# Altium schematic sheet RS-485.SchDoc
size A4; SheetNumber: 10; SheetTotal: 22
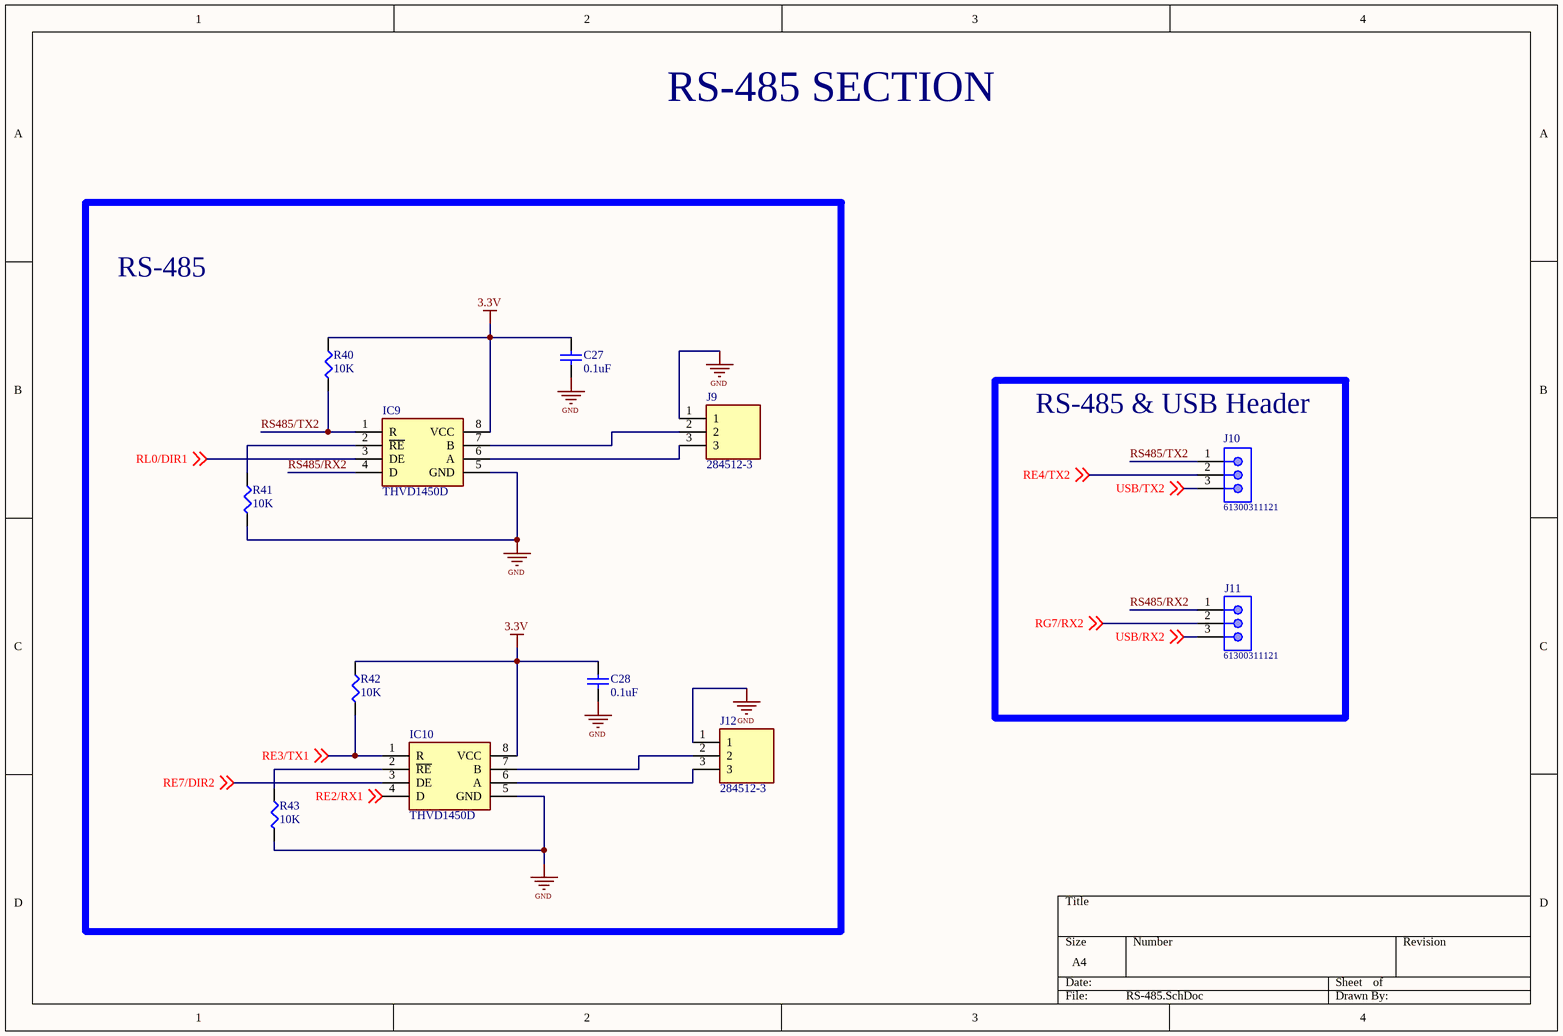
[diagram p0: RS-485.SchDoc]

## Parts
C27  value 0.1uF  [C1206]  (hidden comment: 10pF)
C28  value 0.1uF  [C1206]  (hidden comment: 10pF)
IC9  THVD1450D  [SOIC127P600X175-8N]
IC10  THVD1450D  [SOIC127P600X175-8N]
J9  284512-3  [SHDRRA3W80P0X350_1X3_1250X920X745P]
J10  61300311121  [61300311121]
J11  61300311121  [61300311121]
J12  284512-3  [SHDRRA3W80P0X350_1X3_1250X920X745P]
R40  10K  [SMD-0805-RES]
R41  10K  [SMD-0805-RES]
R42  10K  [SMD-0805-RES]
R43  10K  [SMD-0805-RES]

## Blocks framed on the sheet
RS-485: C27 C28 IC9 IC10 J9 J12 R40-R43
RS-485 & USB Header: J10 J11

## Nets
3.3V: C27.2 C28.2 IC9.8(VCC) IC10.8(VCC) R40.1 R42.1
GND: C27.1 C28.1 IC9.5(GND) IC10.5(GND) J9.1 J12.1 R41.2 R43.2
RE2/RX1: IC10.4(D) ; off-sheet RE2/RX1
RE3/TX1: IC10.1(R) R42.2 ; off-sheet RE3/TX1
RE4/TX2: J10.2 ; off-sheet RE4/TX2
RE7/DIR2: IC10.3(DE) ; off-sheet RE7/DIR2
RG7/RX2: J11.2 ; off-sheet RG7/RX2
RL0/DIR1: IC9.3(DE) ; off-sheet RL0/DIR1
RS485/RX2: IC9.4(D) J11.1
RS485/TX2: IC9.1(R) J10.1 R40.2
USB/RX2: J11.3 ; off-sheet USB/RX2
USB/TX2: J10.3 ; off-sheet USB/TX2
NetIC9_2: IC9.2(~{RE}) R41.1
NetIC9_6: IC9.6(A) J9.3
NetIC9_7: IC9.7(B) J9.2
NetIC10_2: IC10.2(~{RE}) R43.1
NetIC10_6: IC10.6(A) J12.3
NetIC10_7: IC10.7(B) J12.2

## Notes on the sheet
- RS-485 SECTION

## Library data of the parts
C27 C28 = Cap Semi: Capacitor (Semiconductor SIM Model); PART NUMBER: C0603C100M5HACTU; Published: 8-Jun-2000; LatestRevisionDate: 29-May-2009; LatestRevisionNote: IPC-7351 Footprint Added.; PackageReference: C1206; Publisher: Altium Limited; PackageDescription: Chip Capacitor; Source: Mouser
IC9 IC10 = THVD1450D: Integrated Circuit; Manufacturer_Name: Texas Instruments; Datasheet Link: http://www.ti.com/lit/gpn/THVD1450; Height: 1.75mm; Manufacturer_Part_Number: THVD1450D; Mouser Part Number: 595-THVD1450D; Mouser Price/Stock: https://www.mouser.co.uk/ProductDetail/Texas-Instruments/THVD1450D?qs=chTDxNqvsylemUKR9F4kpw%3D%3D; Arrow Part Number: THVD1450D; Arrow Price/Stock: https://www.arrow.com/en/products/thvd1450d/texas-instruments?region=nac
J9 J12 = 284512-3: Connector; Manufacturer_Name: TE Connectivity; Datasheet Link: https://www.te.com/commerce/DocumentDelivery/DDEController?Action=showdoc&DocId=Customer+Drawing%7F284512%7FE4%7Fpdf%7FEnglish%7FENG_CD_284512_E4.pdf%7F284512-3; Height: 7.45mm; Manufacturer_Part_Number: 284512-3; Mouser Part Number: 571-284512-3; Mouser Price/Stock: https://www.mouser.co.uk/ProductDetail/TE-Connectivity/284512-3?qs=woBvfblj%2Fzwah7g8QvojCQ%3D%3D; Arrow Part Number: 284512-3; Arrow Price/Stock: https://www.arrow.com/en/products/284512-3/te-connectivity?region=nac
J10 J11 = 61300311121: WR-PHD Pin Header, THT, pitch 2.54mm, Single Row, Vertical, 3pin; Pin Number: 3; Gender: Male; Rated Current: 3A; Working Voltage: 250VAC; Withstanding Voltage: 500VAC; Contact Resistance: 20mOhm; ComponentLink1Description: Manufacturer; ComponentLink1URL: http://www.we-online.de; ComponentLink2Description: Datasheet; ComponentLink2URL: https://katalog.we-online.de/em/datasheet/6130xx11121.pdf; Part Number: 61300311121; Published Date: June 2019; Publisher: Wurth Elektronik; Pitch: 2.54mm; Operating Temperature: -40 to +105degC; Mounting Technology: THT; Packaging: Bag; Row Number: Single; Orientation: Vertical
R40-R43 = ERJ-6ENF1001V: RES SMD 1K OHM 1% 1/8W 0805; Manufacturer: Panasonic Electronic Components; Factory Stock: 0; Unit Price (USD): 0.00729; @ qty: 1500; Minimum Quantity: 1; Power (Watts): 0.125W, 1/8W; Temperature Coefficient: ±100ppm/°C; Part Number: ERJ-6ENF1001V; Datasheets: http://industrial.panasonic.com/www-cgi/jvcr13pz.cgi?E+PZ+3+AOA0002+ERJ6ENF1001V+7+WW; Image: //media.digikey.com/Renders/Panasonic%20Renders/ERJ-0805%20Pkg.jpg; Digi-Key Part Number: P1.00KCCT-ND; Quantity Available: 12895103; Packaging: Cut Tape (CT); Series: ERJ; Part Status: Active; Value: 1k; Tolerance: ±1%; Composition: Thick Film; Features: Automotive AEC-Q200; Operating Temperature: -55°C ~ 155°C; Package / Case: 0805 (2012 Metric); Supplier Device Package: 0805; Size / Dimension: 0.079" L x 0.049" W (2.00mm x 1.25mm); Height - Seated (Max): 0.028" (0.70mm); Number of Terminations: 2; Failure Rate: -